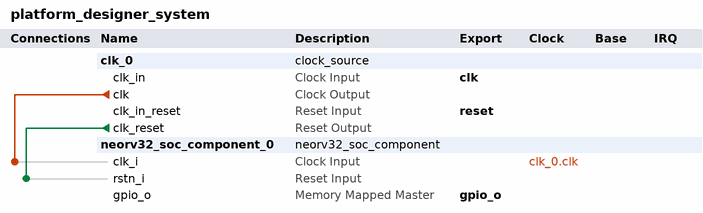
[diagram p0: system contents]
# Platform Designer (Qsys) system platform_designer_system, Cyclone V 5CSEMA5F31C6
# Parameters at their usual value, and those the tool derives, are not listed.
package require -exact qsys 18.1
create_system platform_designer_system
set_project_property DEVICE_FAMILY {Cyclone V}
set_project_property DEVICE 5CSEMA5F31C6

add_instance clk_0 clock_source 18.1
set_instance_parameter_value clk_0 clockFrequency 50000000

add_instance neorv32_soc_component_0 neorv32_soc_component 1.0
set_instance_parameter_value neorv32_soc_component_0 CLOCK_FREQUENCY 50000000
set_instance_parameter_value neorv32_soc_component_0 MEM_INT_DMEM_SIZE 8192
set_instance_parameter_value neorv32_soc_component_0 MEM_INT_IMEM_SIZE 16384

# connections
add_connection clk_0.clk neorv32_soc_component_0.clk_i clock
add_connection clk_0.clk_reset neorv32_soc_component_0.rstn_i reset

# exported interfaces
add_interface clk clock sink
set_interface_property clk EXPORT_OF clk_0.clk_in
add_interface gpio_o avalon master
set_interface_property gpio_o EXPORT_OF neorv32_soc_component_0.gpio_o
add_interface reset reset sink
set_interface_property reset EXPORT_OF clk_0.clk_in_reset

set_interconnect_requirement {$system} qsys_mm.clockCrossingAdapter HANDSHAKE
set_interconnect_requirement {$system} qsys_mm.enableEccProtection FALSE
set_interconnect_requirement {$system} qsys_mm.insertDefaultSlave FALSE
set_interconnect_requirement {$system} qsys_mm.maxAdditionalLatency 1

save_system platform_designer_system.qsys
